# Altium project Icarus.PrjPcb
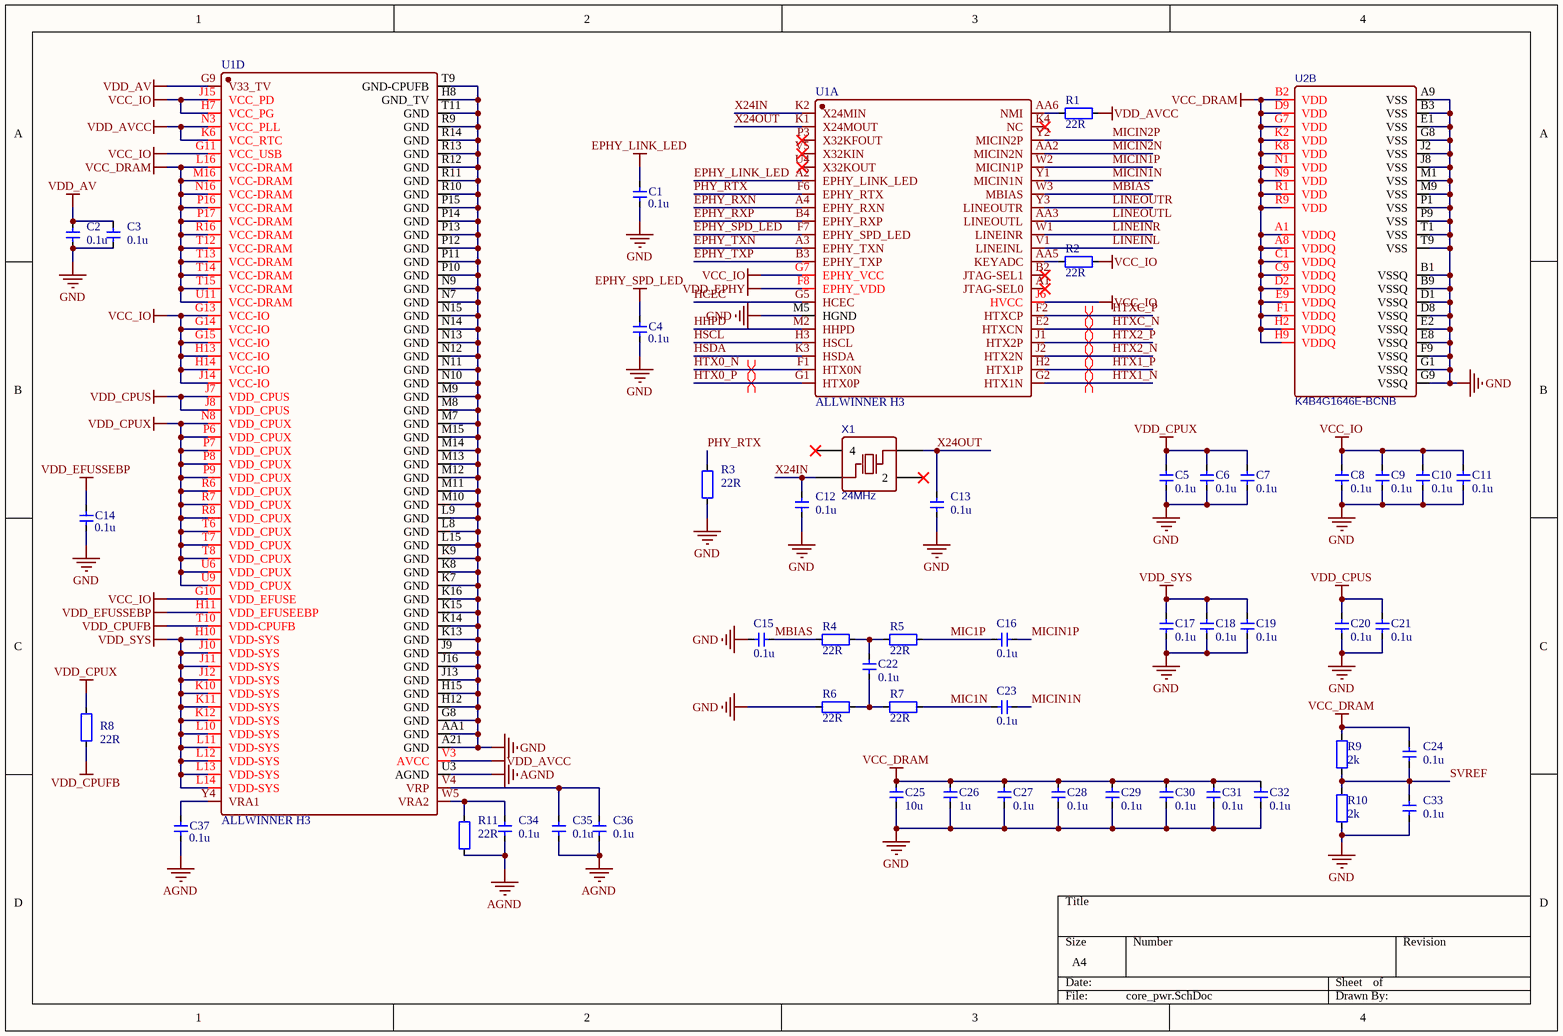
[diagram p0: core_pwr.SchDoc]
5 sheets, 134 parts. Net scope: global (net labels, ports and power ports of the same name join across sheets).
Board file: core.PcbDoc
Sheets:
  core_pwr.SchDoc
  core_app.SchDoc
  power.SchDoc
  conn.SchDoc
  peroherals.SchDoc

## Sheet core_pwr.SchDoc
size A4; SheetNumber: 1; SheetTotal: 5

### Parts
C1  value 0.1u  [C0402]  (hidden comment: CAP-0402)
C2  value 0.1u  [C0402]  (hidden comment: CAP-0402)
C3  value 0.1u  [C0402]  (hidden comment: CAP-0402)
C4  value 0.1u  [C0402]  (hidden comment: CAP-0402)
C5  value 0.1u  [C0402]  (hidden comment: CAP-0402)
C6  value 0.1u  [C0402]  (hidden comment: CAP-0402)
C7  value 0.1u  [C0402]  (hidden comment: CAP-0402)
C8  value 0.1u  [C0402]  (hidden comment: CAP-0402)
C9  value 0.1u  [C0402]  (hidden comment: CAP-0402)
C10  value 0.1u  [C0402]  (hidden comment: CAP-0402)
C11  value 0.1u  [C0402]  (hidden comment: CAP-0402)
C12  value 0.1u  [C0402]  (hidden comment: CAP-0402)
C13  value 0.1u  [C0402]  (hidden comment: CAP-0402)
C14  value 0.1u  [C0402]  (hidden comment: CAP-0402)
C15  value 0.1u  [C0402]  (hidden comment: CAP-0402)
C16  value 0.1u  [C0402]  (hidden comment: CAP-0402)
C17  value 0.1u  [C0402]  (hidden comment: CAP-0402)
C18  value 0.1u  [C0402]  (hidden comment: CAP-0402)
C19  value 0.1u  [C0402]  (hidden comment: CAP-0402)
C20  value 0.1u  [C0402]  (hidden comment: CAP-0402)
C21  value 0.1u  [C0402]  (hidden comment: CAP-0402)
C22  value 0.1u  [C0402]  (hidden comment: CAP-0402)
C23  value 0.1u  [C0402]  (hidden comment: CAP-0402)
C24  value 0.1u  [C0402]  (hidden comment: CAP-0402)
C25  value 10u  [C0402]  (hidden comment: CAP-0402)
C26  value 1u  [C0402]  (hidden comment: CAP-0402)
C27  value 0.1u  [C0402]  (hidden comment: CAP-0402)
C28  value 0.1u  [C0402]  (hidden comment: CAP-0402)
C29  value 0.1u  [C0402]  (hidden comment: CAP-0402)
C30  value 0.1u  [C0402]  (hidden comment: CAP-0402)
C31  value 0.1u  [C0402]  (hidden comment: CAP-0402)
C32  value 0.1u  [C0402]  (hidden comment: CAP-0402)
C33  value 0.1u  [C0402]  (hidden comment: CAP-0402)
C34  value 0.1u  [C0402]  (hidden comment: CAP-0402)
C35  value 0.1u  [C0402]  (hidden comment: CAP-0402)
C36  value 0.1u  [C0402]  (hidden comment: CAP-0402)
C37  value 0.1u  [C0402]  (hidden comment: CAP-0402)
R1  value 22R  [R0402]  (hidden comment: RES-0402)
R2  value 22R  [R0402]  (hidden comment: RES-0402)
R3  value 22R  [R0402]  (hidden comment: RES-0402)
R4  value 22R  [R0402]  (hidden comment: RES-0402)
R5  value 22R  [R0402]  (hidden comment: RES-0402)
R6  value 22R  [R0402]  (hidden comment: RES-0402)
R7  value 22R  [R0402]  (hidden comment: RES-0402)
R8  value 22R  [R0402]  (hidden comment: RES-0402)
R9  value 2k  [R0402]  (hidden comment: RES-0402)
R10  value 2k  [R0402]  (hidden comment: RES-0402)
R11  value 22R  [R0402]  (hidden comment: RES-0402)
U1  ALLWINNER H3  [BGA-347_L14.0-W14.0-R21-C21-P0.65-TL]  (parts A,D of 4)
U2  K4B4G1646E-BCNB  [FBGA-96_L13.5-W7.5-R16-C6-P0.80-TL]  (part B of 2)
X1  24MHz  [OSC-SMD_4P-L3.2-W2.5-BL]

### Nets
AGND: C34.1 C35.1 C36.1 C37.1 R11.1 U1.U3(AGND)
EPHY_LINK_LED: C1.2 U1.A2(EPHY_LINK_LED)
EPHY_SPD_LED: C4.2 U1.F7(EPHY_SPD_LED)
GND: C1.1 C2.1 C3.1 C4.1 C5.2 C6.2 C7.2 C8.2 C9.2 C10.2 C11.2 C12.1 C13.1 C14.1 C15.2 C17.2 C18.2 C19.2 C20.2 C21.2 C25.2 C26.2 C27.2 C28.2 C29.2 C30.2 C31.2 C32.2 C33.1 R3.1 R6.2 R10.2 U1.A21(GND) U1.AA1(GND) U1.G8(GND) U1.H8(GND_TV) U1.H12(GND) U1.H15(GND) U1.J9(GND) U1.J13(GND) U1.J16(GND) U1.K7(GND) U1.K8(GND) U1.K9(GND) U1.K13(GND) U1.K14(GND) U1.K15(GND) U1.K16(GND) U1.L8(GND) U1.L9(GND) U1.L15(GND) U1.M5(HGND) U1.M7(GND) U1.M8(GND) U1.M9(GND) U1.M10(GND) U1.M11(GND) U1.M12(GND) U1.M13(GND) U1.M14(GND) U1.M15(GND) U1.N7(GND) U1.N9(GND) U1.N10(GND) U1.N11(GND) U1.N12(GND) U1.N13(GND) U1.N14(GND) U1.N15(GND) U1.P10(GND) U1.P11(GND) U1.P12(GND) U1.P13(GND) U1.P14(GND) U1.P15(GND) U1.R9(GND) U1.R10(GND) U1.R11(GND) U1.R12(GND) U1.R13(GND) U1.R14(GND) U1.T9(GND-CPUFB) U1.T11(GND) U2.A9(VSS) U2.B1(VSSQ) U2.B3(VSS) U2.B9(VSSQ) U2.D1(VSSQ) U2.D8(VSSQ) U2.E1(VSS) U2.E2(VSSQ) U2.E8(VSSQ) U2.F9(VSSQ) U2.G1(VSSQ) U2.G8(VSS) U2.G9(VSSQ) U2.J2(VSS) U2.J8(VSS) U2.M1(VSS) U2.M9(VSS) U2.P1(VSS) U2.P9(VSS) U2.T1(VSS) U2.T9(VSS)
VCC_DRAM: C24.2 C25.1 C26.1 C27.1 C28.1 C29.1 C30.1 C31.1 C32.1 R9.1 U1.L16(VCC-DRAM) U1.M16(VCC-DRAM) U1.N16(VCC-DRAM) U1.P16(VCC-DRAM) U1.P17(VCC-DRAM) U1.R16(VCC-DRAM) U1.T12(VCC-DRAM) U1.T13(VCC-DRAM) U1.T14(VCC-DRAM) U1.T15(VCC-DRAM) U1.U11(VCC-DRAM) U2.A1(VDDQ) U2.A8(VDDQ) U2.B2(VDD) U2.C1(VDDQ) U2.C9(VDDQ) U2.D2(VDDQ) U2.D9(VDD) U2.E9(VDDQ) U2.F1(VDDQ) U2.G7(VDD) U2.H2(VDDQ) U2.H9(VDDQ) U2.K2(VDD) U2.K8(VDD) U2.N1(VDD) U2.N9(VDD) U2.R1(VDD) U2.R9(VDD)
VCC_IO: C8.1 C9.1 C10.1 C11.1 R2.1 U1.G7(EPHY_VCC) U1.G10(VDD_EFUSE) U1.G11(VCC_USB) U1.G13(VCC-IO) U1.G14(VCC-IO) U1.G15(VCC-IO) U1.H7(VCC_PG) U1.H13(VCC-IO) U1.H14(VCC-IO) U1.J6(HVCC) U1.J14(VCC-IO) U1.J15(VCC_PD)
VDD_AV: C2.2 C3.2 U1.G9(V33_TV)
VDD_AVCC: R1.1 U1.K6(VCC_RTC) U1.N3(VCC_PLL) U1.V3(AVCC)
VDD_CPUFB: R8.1 U1.T10(VDD-CPUFB)
VDD_CPUS: C20.1 C21.1 U1.J7(VDD_CPUS) U1.J8(VDD_CPUS)
VDD_CPUX: C5.1 C6.1 C7.1 R8.2 U1.N8(VDD_CPUX) U1.P6(VDD_CPUX) U1.P7(VDD_CPUX) U1.P8(VDD_CPUX) U1.P9(VDD_CPUX) U1.R6(VDD_CPUX) U1.R7(VDD_CPUX) U1.R8(VDD_CPUX) U1.T6(VDD_CPUX) U1.T7(VDD_CPUX) U1.T8(VDD_CPUX) U1.U6(VDD_CPUX) U1.U9(VDD_CPUX)
VDD_EFUSSEBP: C14.2 U1.H11(VDD_EFUSEEBP)
VDD_EPHY: U1.F8(EPHY_VDD)
VDD_SYS: C17.1 C18.1 C19.1 U1.H10(VDD-SYS) U1.J10(VDD-SYS) U1.J11(VDD-SYS) U1.J12(VDD-SYS) U1.K10(VDD-SYS) U1.K11(VDD-SYS) U1.K12(VDD-SYS) U1.L10(VDD-SYS) U1.L11(VDD-SYS) U1.L12(VDD-SYS) U1.L13(VDD-SYS) U1.L14(VDD-SYS)
EPHY_RXN: U1.A4(EPHY_RXN)
EPHY_RXP: U1.B4(EPHY_RXP)
EPHY_TXN: U1.A3(EPHY_TXN)
EPHY_TXP: U1.B3(EPHY_TXP)
HCEC: U1.G5(HCEC)
HHPD: U1.M2(HHPD)
HSCL: U1.H3(HSCL)
HSDA: U1.K3(HSDA)
HTX0_N: U1.F1(HTX0N)
HTX0_P: U1.G1(HTX0P)
HTX1_N: U1.G2(HTX1N)
HTX1_P: U1.H2(HTX1P)
HTX2_N: U1.J2(HTX2N)
HTX2_P: U1.J1(HTX2P)
HTXC_N: U1.E2(HTXCN)
HTXC_P: U1.F2(HTXCP)
LINEINL: U1.V1(LINEINL)
LINEINR: U1.W1(LINEINR)
LINEOUTL: U1.AA3(LINEOUTL)
LINEOUTR: U1.Y3(LINEOUTR)
MBIAS: C15.1 R4.2 U1.W3(MBIAS)
MIC1N: C23.1 R7.2
MIC1P: C16.2 R5.1
MICIN1N: C23.2 U1.Y1(MICIN1N)
MICIN1P: C16.1 U1.W2(MICIN1P)
MICIN2N: U1.AA2(MICIN2N)
MICIN2P: U1.Y2(MICIN2P)
PHY_RTX: R3.2 U1.F6(EPHY_RTX)
SVREF: C24.1 C33.2 R9.2 R10.1
X24IN: C12.2 U1.K2(X24MIN) X1.1(OSC1)
X24OUT: C13.2 U1.K1(X24MOUT) X1.3(OSC2)
NetC22_1: C22.1 R4.1 R5.2
NetC22_2: C22.2 R6.1 R7.1
NetC34_2: C34.2 R11.2 U1.W5(VRA2)
NetC35_2: C35.2 C36.2 U1.V4(VRP)
NetC37_2: C37.2 U1.Y4(VRA1)
NetR1_2: R1.2 U1.AA6(NMI)
NetR2_2: R2.2 U1.AA5(KEYADC)

Not connected (* = marked no-connect by the designer): U1 A1(JTAG-SEL0)* B2(JTAG-SEL1)* K4(NC)* P3(X32KFOUT)* U4(X32KOUT)* V5(X32KIN)*; X1 2* 4*

### Layout directives
differential pair: HTX0_N, HTX0_P, HTX1_N, HTX1_P, HTX2_N, HTX2_P, HTXC_N, HTXC_P

### Library data of the parts
C1-C37 = CAP-0402: Capacitor
R1-R11 = RES-0402: Resistor
U2 = K4B4G1646E-BCNB: BOM_Manufacturer: SAMSUNG(三星半导体); Contributor: LCSC; BOM_Supplier Part: C2803248; BOM_Manufacturer Part: K4B4G1646E-BCNB; BOM_JLCPCB Part Class: Extended Part; spicePre: U; spiceSymbolName: K4B4G1646E-BCNB; BOM_Supplier: LCSC
X1 = 24MHz: BOM_Manufacturer: KDS; BOM_Manufacturer Part: DSX321G 24MHz; nameAlias: Frequency; Contributor: LCSC; BOM_Supplier: LCSC; BOM_Supplier Part: C93235; BOM_JLCPCB Part Class: Extended Part; spicePre: X; spiceSymbolName: DSX321G 24MHz

## Sheet core_app.SchDoc
size A4; SheetNumber: 2; SheetTotal: 5
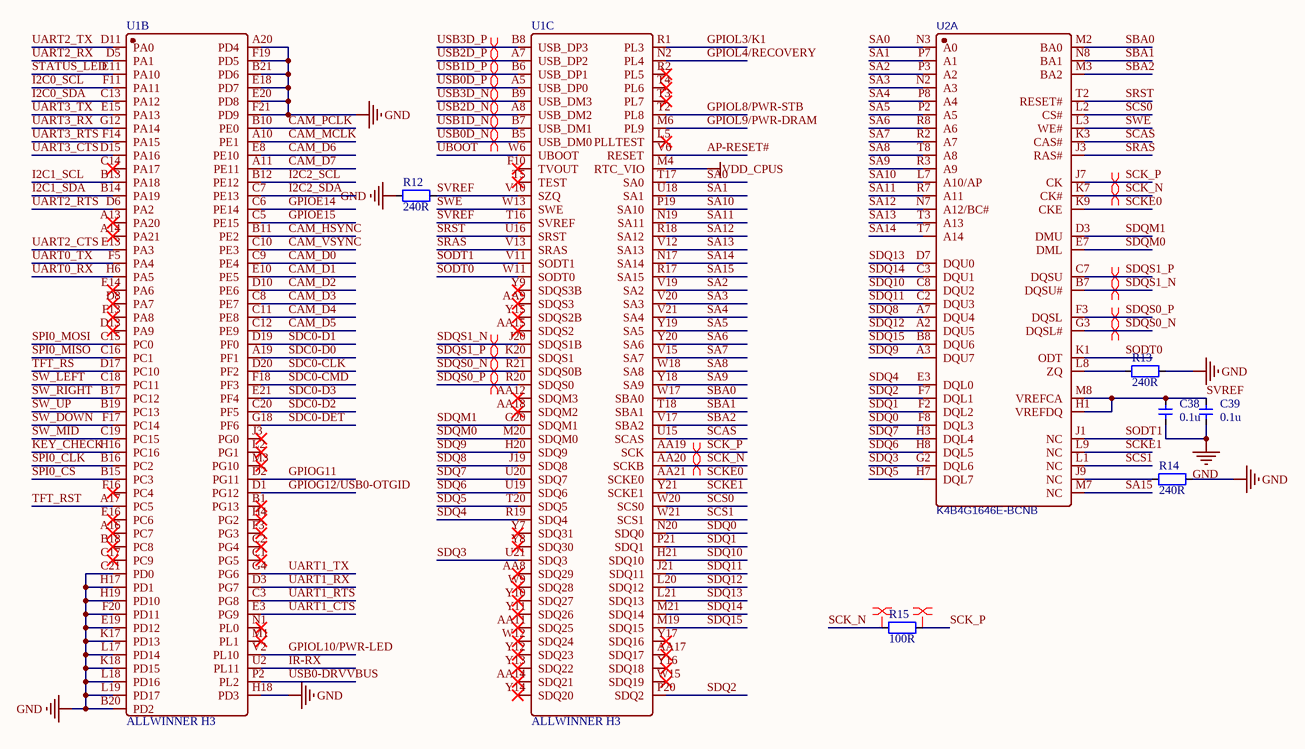
[diagram p1: core_app.SchDoc]

### Parts
C38  value 0.1u  [C0402]  (hidden comment: CAP-0402)
C39  value 0.1u  [C0402]  (hidden comment: CAP-0402)
R12  value 240R  [R0402]  (hidden comment: RES-0402)
R13  value 240R  [R0402]  (hidden comment: RES-0402)
R14  value 240R  [R0402]  (hidden comment: RES-0402)
R15  value 100R  [R0402]  (hidden comment: RES-0402)
U1  ALLWINNER H3  [BGA-347_L14.0-W14.0-R21-C21-P0.65-TL]  (parts B,C of 4)
U2  K4B4G1646E-BCNB  [FBGA-96_L13.5-W7.5-R16-C6-P0.80-TL]  (part A of 2)

### Nets
GND: C38.1 C39.1 R12.2 R13.1 R14.1 U1.A20(PD4) U1.B20(PD2) U1.B21(PD6) U1.C21(PD0) U1.E18(PD7) U1.E19(PD12) U1.E20(PD8) U1.F19(PD5) U1.F20(PD11) U1.F21(PD9) U1.H17(PD1) U1.H18(PD3) U1.H19(PD10) U1.K17(PD13) U1.K18(PD15) U1.L17(PD14) U1.L18(PD16) U1.L19(PD17)
VDD_CPUS: U1.M4(RTC_VIO)
AP-RESET#: U1.V6(RESET)
CAM_D0: U1.C9(PE4)
CAM_D1: U1.E10(PE5)
CAM_D2: U1.D10(PE6)
CAM_D3: U1.C8(PE7)
CAM_D4: U1.C11(PE8)
CAM_D5: U1.C12(PE9)
CAM_D6: U1.E8(PE10)
CAM_D7: U1.A11(PE11)
CAM_HSYNC: U1.B11(PE2)
CAM_MCLK: U1.A10(PE1)
CAM_PCLK: U1.B10(PE0)
CAM_VSYNC: U1.C10(PE3)
GPIOE14: U1.C6(PE14)
GPIOE15: U1.C5(PE15)
GPIOG11: U1.D2(PG11)
GPIOG12/USB0-OTGID: U1.D1(PG12)
GPIOL3/K1: U1.R1(PL3)
GPIOL4/RECOVERY: U1.N2(PL4)
GPIOL8/PWR-STB: U1.T2(PL8)
GPIOL9/PWR-DRAM: U1.M6(PL9)
GPIOL10/PWR-LED: U1.V2(PL10)
I2C0_SCL: U1.F11(PA11)
I2C0_SDA: U1.C13(PA12)
I2C1_SCL: U1.B13(PA18)
I2C1_SDA: U1.B14(PA19)
I2C2_SCL: U1.B12(PE12)
I2C2_SDA: U1.C7(PE13)
IR-RX: U1.U2(PL11)
KEY_CHECK: U1.H16(PC16)
SA0: U1.T17(SA0) U2.N3(A0)
SA1: U1.U18(SA1) U2.P7(A1)
SA2: U1.V19(SA2) U2.P3(A2)
SA3: U1.V20(SA3) U2.N2(A3)
SA4: U1.V21(SA4) U2.P8(A4)
SA5: U1.Y19(SA5) U2.P2(A5)
SA6: U1.Y20(SA6) U2.R8(A6)
SA7: U1.V15(SA7) U2.R2(A7)
SA8: U1.W18(SA8) U2.T8(A8)
SA9: U1.Y18(SA9) U2.R3(A9)
SA10: U1.P19(SA10) U2.L7(A10/AP)
SA11: U1.N19(SA11) U2.R7(A11)
SA12: U1.R18(SA12) U2.N7(A12/BC#)
SA13: U1.V12(SA13) U2.T3(A13)
SA14: U1.N17(SA14) U2.T7(A14)
SA15: U1.R17(SA15) U2.M7(NC)
SBA0: U1.W17(SBA0) U2.M2(BA0)
SBA1: U1.T18(SBA1) U2.N8(BA1)
SBA2: U1.V17(SBA2) U2.M3(BA2)
SCAS: U1.U15(SCAS) U2.K3(CAS#)
SCK_N: R15.2 U1.AA20(SCKB) U2.K7(CK#)
SCK_P: R15.1 U1.AA19(SCK) U2.J7(CK)
SCKE0: U1.AA21(SCKE0) U2.K9(CKE)
SCKE1: U1.Y21(SCKE1) U2.L9(NC)
SCS0: U1.W20(SCS0) U2.L2(CS#)
SCS1: U1.W21(SCS1) U2.L1(NC)
SDC0-CLK: U1.D20(PF2)
SDC0-CMD: U1.F18(PF3)
SDC0-D0: U1.A19(PF1)
SDC0-D1: U1.D19(PF0)
SDC0-D2: U1.C20(PF5)
SDC0-D3: U1.E21(PF4)
SDC0-DET: U1.G18(PF6)
SDQ0: U1.N20(SDQ0) U2.F8(DQL3)
SDQ1: U1.P21(SDQ1) U2.F2(DQL2)
SDQ2: U1.P20(SDQ2) U2.F7(DQL1)
SDQ3: U1.U21(SDQ3) U2.G2(DQL6)
SDQ4: U1.R19(SDQ4) U2.E3(DQL0)
SDQ5: U1.T20(SDQ5) U2.H7(DQL7)
SDQ6: U1.U19(SDQ6) U2.H8(DQL5)
SDQ7: U1.U20(SDQ7) U2.H3(DQL4)
SDQ8: U1.J19(SDQ8) U2.A7(DQU4)
SDQ9: U1.H20(SDQ9) U2.A3(DQU7)
SDQ10: U1.H21(SDQ10) U2.C8(DQU2)
SDQ11: U1.J21(SDQ11) U2.C2(DQU3)
SDQ12: U1.L20(SDQ12) U2.A2(DQU5)
SDQ13: U1.L21(SDQ13) U2.D7(DQU0)
SDQ14: U1.M21(SDQ14) U2.C3(DQU1)
SDQ15: U1.M19(SDQ15) U2.B8(DQU6)
SDQM0: U1.M20(SDQM0) U2.E7(DML)
SDQM1: U1.G20(SDQM1) U2.D3(DMU)
SDQS0_N: U1.R21(SDQS0B) U2.G3(DQSL#)
SDQS0_P: U1.R20(SDQS0) U2.F3(DQSL)
SDQS1_N: U1.J20(SDQS1B) U2.B7(DQSU#)
SDQS1_P: U1.K20(SDQS1) U2.C7(DQSU)
SODT0: U1.W11(SODT0) U2.K1(ODT)
SODT1: U1.V11(SODT1) U2.J1(NC)
SPI0_CLK: U1.B16(PC2)
SPI0_CS: U1.B15(PC3)
SPI0_MISO: U1.C16(PC1)
SPI0_MOSI: U1.C15(PC0)
SRAS: U1.V13(SRAS) U2.J3(RAS#)
SRST: U1.U16(SRST) U2.T2(RESET#)
STATUS_LED: U1.E11(PA10)
SVREF: C38.2 C39.2 R12.1 U1.T16(SVREF) U1.V10(SZQ) U2.H1(VREFDQ) U2.M8(VREFCA)
SW_DOWN: U1.F17(PC14)
SW_LEFT: U1.C18(PC11)
SW_MID: U1.C19(PC15)
SW_RIGHT: U1.B17(PC12)
SW_UP: U1.B19(PC13)
SWE: U1.W13(SWE) U2.L3(WE#)
TFT_RS: U1.D17(PC10)
TFT_RST: U1.A17(PC5)
UART0_RX: U1.H6(PA5)
UART0_TX: U1.F5(PA4)
UART1_CTS: U1.E3(PG9)
UART1_RTS: U1.C3(PG8)
UART1_RX: U1.D3(PG7)
UART1_TX: U1.G4(PG6)
UART2_CTS: U1.E13(PA3)
UART2_RTS: U1.D6(PA2)
UART2_RX: U1.D5(PA1)
UART2_TX: U1.D11(PA0)
UART3_CTS: U1.D15(PA16)
UART3_RTS: U1.F14(PA15)
UART3_RX: U1.G12(PA14)
UART3_TX: U1.E15(PA13)
UBOOT: U1.W6(UBOOT)
USB0-DRVVBUS: U1.P2(PL2)
USB0D_N: U1.B5(USB_DM0)
USB0D_P: U1.A5(USB_DP0)
USB1D_N: U1.B7(USB_DM1)
USB1D_P: U1.B6(USB_DP1)
USB2D_N: U1.A8(USB_DM2)
USB2D_P: U1.A7(USB_DP2)
USB3D_N: U1.B9(USB_DM3)
USB3D_P: U1.B8(USB_DP3)
NetR13_2: R13.2 U2.L8(ZQ)
NetR14_2: R14.2 U2.J9(NC)

Not connected (* = marked no-connect by the designer): U1 A13(PA20)* A14(PA21)* A16(PC7)* AA8(SDQ29)* AA9(SDQS3)* AA11(SDQ25)* AA12(SDQM3)* AA14(SDQ21)* AA15(SDQS2)* AA17(SDQ17)* AA18(SDQM2)* B1(PG13)* B18(PC8)* C1(PG5)* C2(PG4)* C14(PA17)* C17(PC9)* D8(PA7)* D13(PA9)* E14(PA6)* E16(PC6)* F3(PG3)* F10(TVOUT)* F13(PA8)* F16(PC4)* H4(PG2)* J3(PG0)* L2(PG1)* L5(PLLTEST)* M1(PL1)* M3(PG10)* N1(PL0)* R2(PL5)* T3(PL7)* T4(PL6)* T5(TEST)* W9(SDQ28)* W12(SDQ24)* W15(SDQ19)* Y7(SDQ31)* Y8(SDQ30)* Y9(SDQS3B)* Y10(SDQ27)* Y11(SDQ26)* Y12(SDQ23)* Y13(SDQ22)* Y14(SDQ20)* Y15(SDQS2B)* Y16(SDQ18)* Y17(SDQ16)*

### Layout directives
differential pair: SCK_N, SCK_P, SDQS0_N, SDQS0_P, SDQS1_N, SDQS1_P, USB0D_N, USB0D_P, USB1D_N, USB1D_P, USB2D_N, USB2D_P, USB3D_N, USB3D_P

### Library data of the parts
C38 C39 = CAP-0402: Capacitor
R12-R15 = RES-0402: Resistor
U2 = K4B4G1646E-BCNB: as U2 on sheet core_pwr; BOM_Supplier Part: C2803248; BOM_Manufacturer Part: K4B4G1646E-BCNB; BOM_JLCPCB Part Class: Extended Part; spicePre: U; spiceSymbolName: K4B4G1646E-BCNB; BOM_Supplier: LCSC

## Sheet power.SchDoc
size A4; SheetNumber: 3; SheetTotal: 5
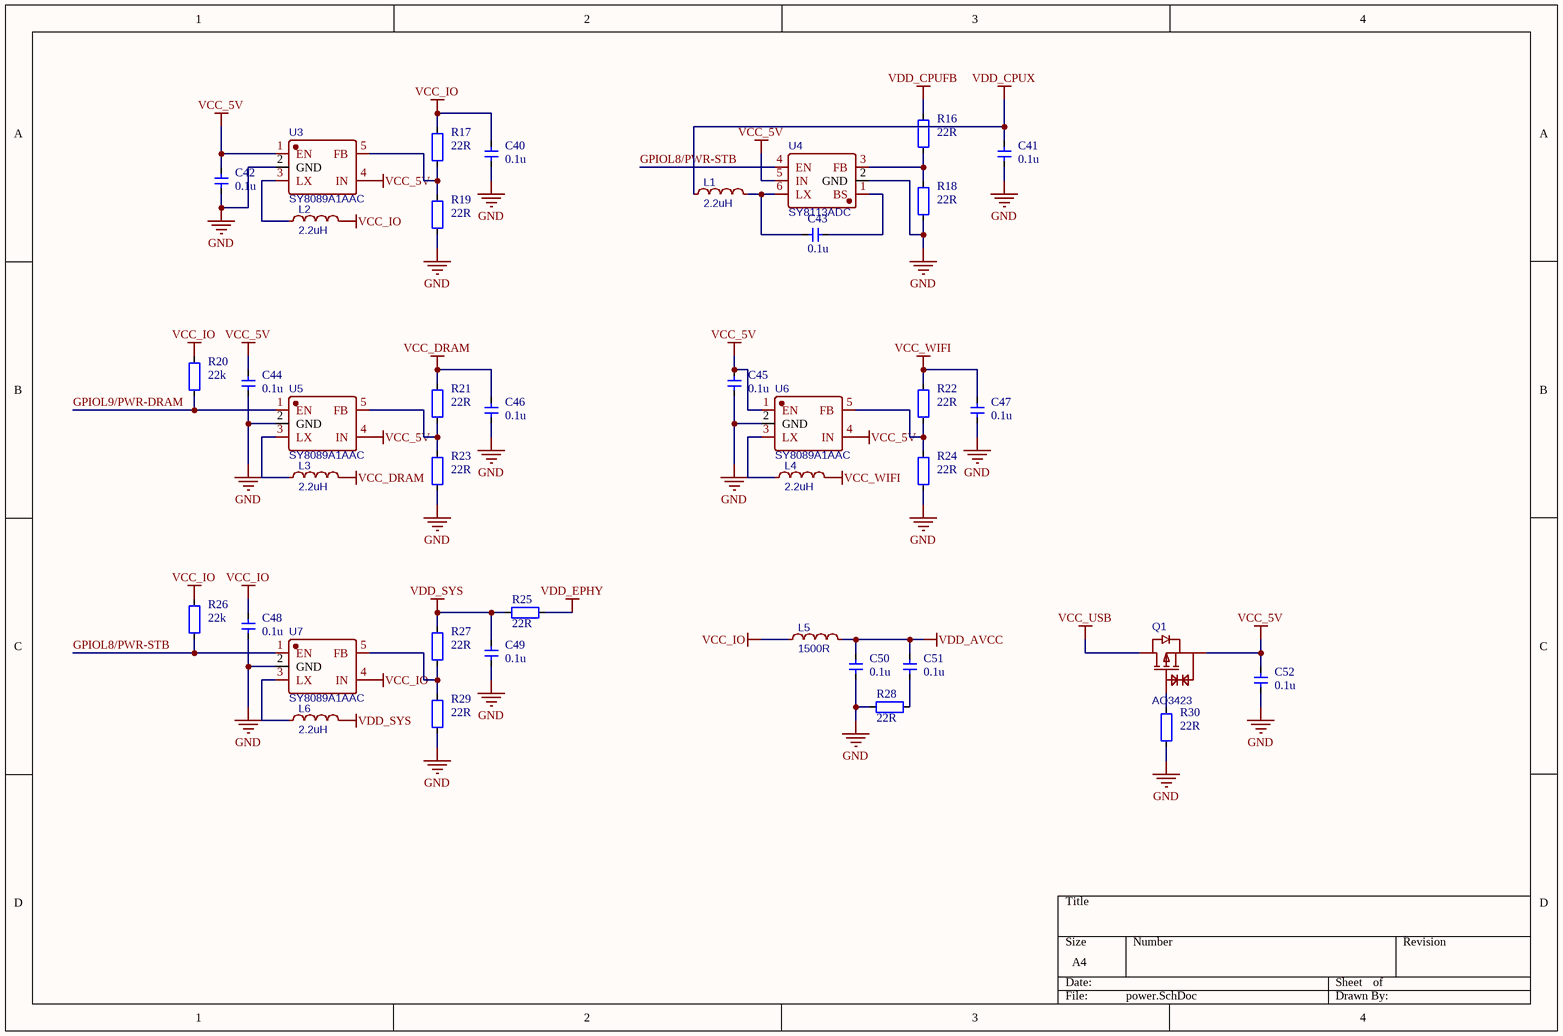
[diagram p2: power.SchDoc]

### Parts
C40  value 0.1u  [C0402]  (hidden comment: CAP-0402)
C41  value 0.1u  [C0402]  (hidden comment: CAP-0402)
C42  value 0.1u  [C0402]  (hidden comment: CAP-0402)
C43  value 0.1u  [C0402]  (hidden comment: CAP-0402)
C44  value 0.1u  [C0402]  (hidden comment: CAP-0402)
C45  value 0.1u  [C0402]  (hidden comment: CAP-0402)
C46  value 0.1u  [C0402]  (hidden comment: CAP-0402)
C47  value 0.1u  [C0402]  (hidden comment: CAP-0402)
C48  value 0.1u  [C0402]  (hidden comment: CAP-0402)
C49  value 0.1u  [C0402]  (hidden comment: CAP-0402)
C50  value 0.1u  [C0402]  (hidden comment: CAP-0402)
C51  value 0.1u  [C0402]  (hidden comment: CAP-0402)
C52  value 0.1u  [C0402]  (hidden comment: CAP-0402)
L1  2.2uH  [IND-SMD_L4.4-W4.2]
L2  2.2uH  [IND-SMD_L4.4-W4.2]
L3  2.2uH  [IND-SMD_L4.4-W4.2]
L4  2.2uH  [IND-SMD_L4.4-W4.2]
L5  1500R  [L0402]
L6  2.2uH  [IND-SMD_L4.4-W4.2]
Q1  AO3423  [SOT-23-3_L2.9-W1.6-P1.90-LS2.8-BR]
R16  value 22R  [R0402]  (hidden comment: RES-0402)
R17  value 22R  [R0402]  (hidden comment: RES-0402)
R18  value 22R  [R0402]  (hidden comment: RES-0402)
R19  value 22R  [R0402]  (hidden comment: RES-0402)
R20  value 22k  [R0402]  (hidden comment: RES-0402)
R21  value 22R  [R0402]  (hidden comment: RES-0402)
R22  value 22R  [R0402]  (hidden comment: RES-0402)
R23  value 22R  [R0402]  (hidden comment: RES-0402)
R24  value 22R  [R0402]  (hidden comment: RES-0402)
R25  value 22R  [R0402]  (hidden comment: RES-0402)
R26  value 22k  [R0402]  (hidden comment: RES-0402)
R27  value 22R  [R0402]  (hidden comment: RES-0402)
R28  value 22R  [R0402]  (hidden comment: RES-0402)
R29  value 22R  [R0402]  (hidden comment: RES-0402)
R30  value 22R  [R0402]  (hidden comment: RES-0402)
U3  SY8089A1AAC  [SOT-23-5_L3.0-W1.7-P0.95-LS2.8-BL]
U4  SY8113ADC  [TSOT-23-6_L2.9-W1.6-P0.95-LS2.8-BR]
U5  SY8089A1AAC  [SOT-23-5_L3.0-W1.7-P0.95-LS2.8-BL]
U6  SY8089A1AAC  [SOT-23-5_L3.0-W1.7-P0.95-LS2.8-BL]
U7  SY8089A1AAC  [SOT-23-5_L3.0-W1.7-P0.95-LS2.8-BL]

### Nets
GND: C40.1 C41.1 C42.1 C44.1 C45.1 C46.1 C47.1 C48.1 C49.1 C50.1 C52.1 R18.1 R19.1 R23.1 R24.1 R28.2 R29.1 R30.1 U3.2(GND) U4.2(GND) U5.2(GND) U6.2(GND) U7.2(GND)
VCC_5V: C42.2 C44.2 C45.2 C52.2 Q1.2(S) U3.1(EN) U3.4(IN) U4.5(IN) U5.4(IN) U6.1(EN) U6.4(IN)
VCC_DRAM: C46.2 L3.2 R21.2
VCC_IO: C40.2 C48.2 L2.2 L5.1 R17.2 R20.2 R26.2 U7.4(IN)
VCC_USB: Q1.3(D)
VCC_WIFI: C47.2 L4.2 R22.2
VDD_AVCC: C50.2 C51.2 L5.2
VDD_CPUFB: R16.2
VDD_CPUX: C41.2 L1.1
VDD_EPHY: R25.1
VDD_SYS: C49.2 L6.2 R25.2 R27.2
GPIOL8/PWR-STB: R26.1 U4.4(EN) U7.1(EN)
GPIOL9/PWR-DRAM: R20.1 U5.1(EN)
NetC43_1: C43.1 U4.1(BS)
NetC43_2: C43.2 L1.2 U4.6(LX)
NetC51_1: C51.1 R28.1
NetL2_1: L2.1 U3.3(LX)
NetL3_1: L3.1 U5.3(LX)
NetL4_1: L4.1 U6.3(LX)
NetL6_1: L6.1 U7.3(LX)
NetQ1_1: Q1.1(G) R30.2
NetR16_1: R16.1 R18.2 U4.3(FB)
NetR17_1: R17.1 R19.2 U3.5(FB)
NetR21_1: R21.1 R23.2 U5.5(FB)
NetR22_1: R22.1 R24.2 U6.5(FB)
NetR27_1: R27.1 R29.2 U7.5(FB)

### Library data of the parts
C40-C52 = CAP-0402: Capacitor
L1-L4 L6 = IND_0420: BOM_Manufacturer: TDG; BOM_Manufacturer Part: TMAX-0420-2R2-M; nameAlias: Inductance; Contributor: LCSC; BOM_Supplier: LCSC; BOM_Supplier Part: C429763; spicePre: L; spiceSymbolName: TMAX-0420-2R2-M
L5 = IND_0402: nameAlias: Value(H); Contributor: LCEDA_Lib; spicePre: L; spiceSymbolName: L0402_US
Q1 = AO3423: BOM_Manufacturer: AOS; BOM_Supplier: LCSC; BOM_Manufacturer Part: AO3423; BOM_Supplier Part: C73257; BOM_JLCPCB Part Class: Extended Part; spicePre: Q; spiceSymbolName: AO3423
R16-R30 = RES-0402: Resistor
U3 U5-U7 = SY8089A1AAC: BOM_Manufacturer: Silergy Corp; Contributor: LCSC; BOM_Supplier: LCSC; BOM_Supplier Part: C479074; BOM_Manufacturer Part: SY8089A1AAC; BOM_JLCPCB Part Class: Extended Part; spicePre: U; spiceSymbolName: SY8089A1AAC
U4 = SY8113ADC: BOM_Manufacturer: Silergy Corp; Contributor: LCSC; BOM_Supplier: LCSC; BOM_Supplier Part: C403810; BOM_Manufacturer Part: SY8113ADC; BOM_JLCPCB Part Class: Extended Part; spicePre: U; spiceSymbolName: SY8113ADC

## Sheet conn.SchDoc
size A4; SheetNumber: 4; SheetTotal: 5
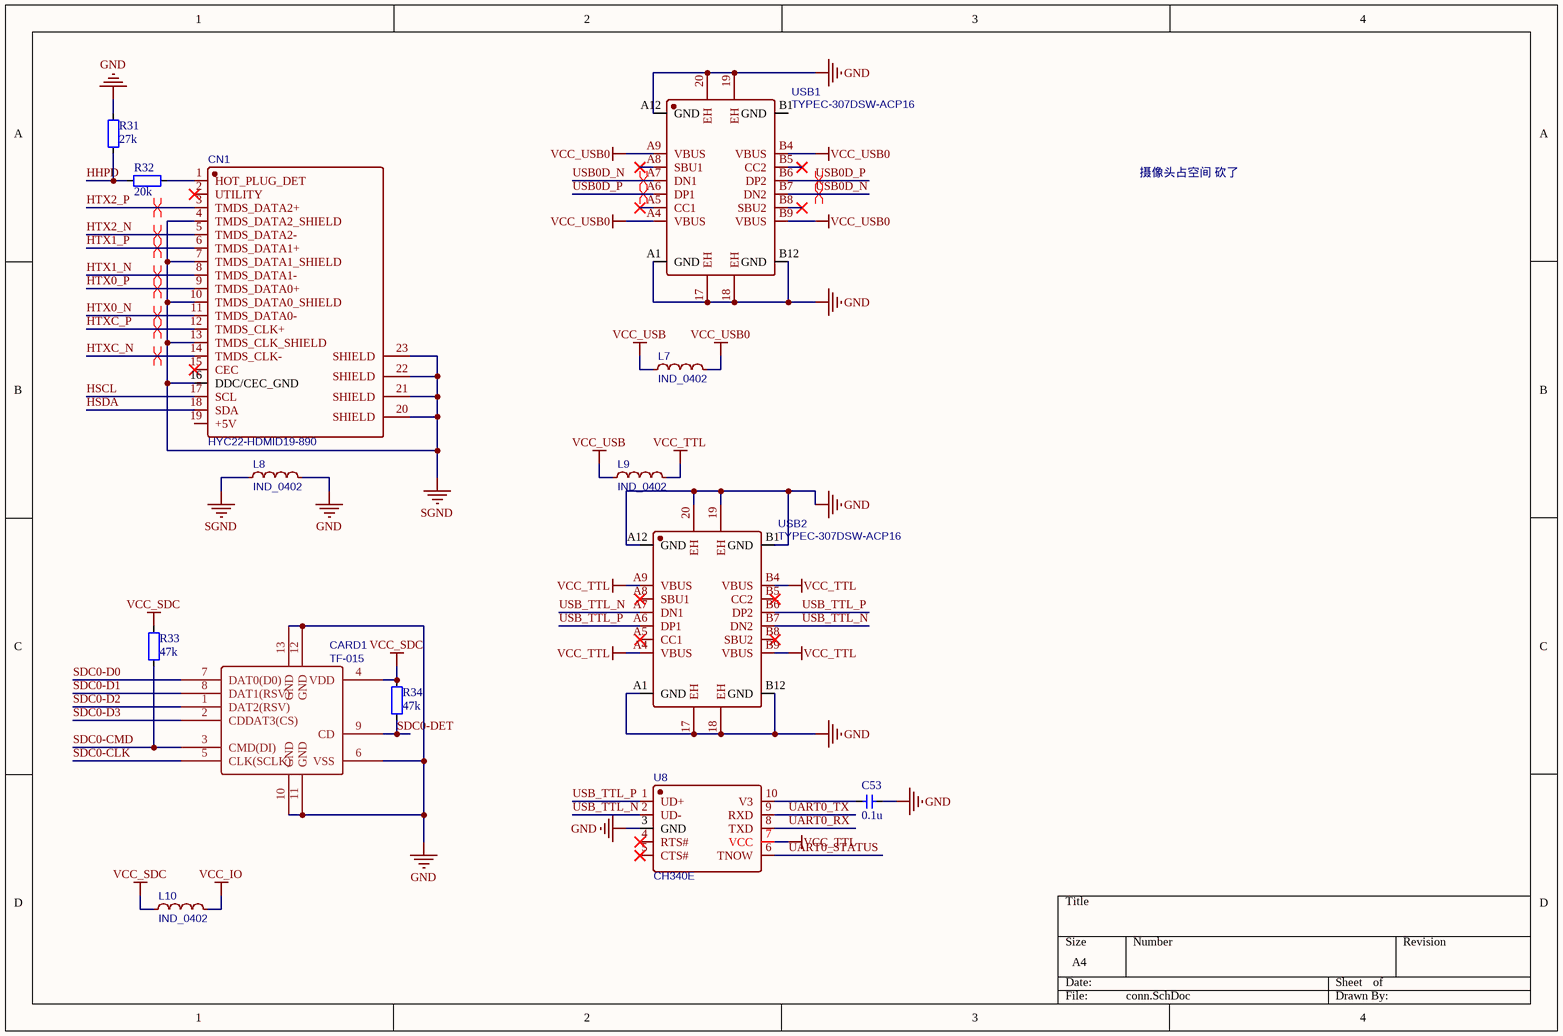
[diagram p3: conn.SchDoc]

### Parts
C53  value 0.1u  [C0402]  (hidden comment: CAP-0402)
CARD1  TF-015  [TF-SMD_TF-015]
CN1  HYC22-HDMID19-890  [HDMI-SMD_HYC22-HDMID19-890]
L7  IND_0402  [L0402]
L8  IND_0402  [L0402]
L9  IND_0402  [L0402]
L10  IND_0402  [L0402]
R31  value 27k  [R0402]  (hidden comment: RES-0402)
R32  value 20k  [R0402]  (hidden comment: RES-0402)
R33  value 47k  [R0402]  (hidden comment: RES-0402)
R34  value 47k  [R0402]  (hidden comment: RES-0402)
U8  CH340E  [MSOP-10_L3.0-W3.0-P0.50-LS5.0-BL]
USB1  TYPEC-307DSW-ACP16  [USB-C-SMD_TYPEC-307DSW-ACP16]
USB2  TYPEC-307DSW-ACP16  [USB-C-SMD_TYPEC-307DSW-ACP16]

### Nets
GND: C53.1 CARD1.6(VSS) CARD1.10(GND) CARD1.11(GND) CARD1.12(GND) CARD1.13(GND) L8.2 R31.1 U8.3(GND) USB1.17(EH) USB1.18(EH) USB1.19(EH) USB1.20(EH) USB1.A1(GND) USB1.A12(GND) USB1.B12(GND) USB2.17(EH) USB2.18(EH) USB2.19(EH) USB2.20(EH) USB2.A1(GND) USB2.A12(GND) USB2.B1(GND) USB2.B12(GND)
SGND: CN1.4(TMDS_DATA2_SHIELD) CN1.7(TMDS_DATA1_SHIELD) CN1.10(TMDS_DATA0_SHIELD) CN1.13(TMDS_CLK_SHIELD) CN1.16(DDC/CEC_GND) CN1.20(SHIELD) CN1.21(SHIELD) CN1.22(SHIELD) CN1.23(SHIELD) L8.1
VCC_IO: L10.2
VCC_SDC: CARD1.4(VDD) L10.1 R33.1 R34.1
VCC_TTL: L9.2 U8.7(VCC) USB2.A4(VBUS) USB2.A9(VBUS) USB2.B4(VBUS) USB2.B9(VBUS)
VCC_USB: L7.1 L9.1
VCC_USB0: L7.2 USB1.A4(VBUS) USB1.A9(VBUS) USB1.B4(VBUS) USB1.B9(VBUS)
HHPD: R31.2 R32.2
HSCL: CN1.17(SCL)
HSDA: CN1.18(SDA)
HTX0_N: CN1.11(TMDS_DATA0-)
HTX0_P: CN1.9(TMDS_DATA0+)
HTX1_N: CN1.8(TMDS_DATA1-)
HTX1_P: CN1.6(TMDS_DATA1+)
HTX2_N: CN1.5(TMDS_DATA2-)
HTX2_P: CN1.3(TMDS_DATA2+)
HTXC_N: CN1.14(TMDS_CLK-)
HTXC_P: CN1.12(TMDS_CLK+)
SDC0-CLK: CARD1.5(CLK(SCLK))
SDC0-CMD: CARD1.3(CMD(DI)) R33.2
SDC0-D0: CARD1.7(DAT0(D0))
SDC0-D1: CARD1.8(DAT1(RSV))
SDC0-D2: CARD1.1(DAT2(RSV))
SDC0-D3: CARD1.2(CDDAT3(CS))
SDC0-DET: CARD1.9(CD) R34.2
UART0_RX: U8.8(TXD)
UART0_STATUS: U8.6(TNOW)
UART0_TX: U8.9(RXD)
USB0D_N: USB1.A7(DN1) USB1.B7(DN2)
USB0D_P: USB1.A6(DP1) USB1.B6(DP2)
USB_TTL_N: U8.2(UD-) USB2.A7(DN1) USB2.B7(DN2)
USB_TTL_P: U8.1(UD+) USB2.A6(DP1) USB2.B6(DP2)
NetC53_2: C53.2 U8.10(V3)
NetCN1_1: CN1.1(HOT_PLUG_DET) R32.1

Not connected (* = marked no-connect by the designer): CN1 2(UTILITY)* 15(CEC)* 19(+5V); U8 4(RTS#)* 5(CTS#)*; USB1 A5(CC1)* A8(SBU1)* B1(GND) B5(CC2)* B8(SBU2)*; USB2 A5(CC1)* A8(SBU1)* B5(CC2)* B8(SBU2)*

### Layout directives
differential pair: HTX0_N, HTX0_P, HTX1_N, HTX1_P, HTX2_N, HTX2_P, HTXC_N, HTXC_P, USB0D_N, USB0D_P

### Notes on the sheet
- 摄像头占空间 砍了

### Library data of the parts
C53 = CAP-0402: Capacitor
CARD1 = TF-015: BOM_Manufacturer: SOFNG; BOM_Supplier: LCSC; BOM_Manufacturer Part: TF-015; BOM_Supplier Part: C113206; spicePre: C; spiceSymbolName: TF-015
CN1 = HYC22-HDMID19-890: BOM_Manufacturer: HOAUC; Contributor: LCSC; BOM_Supplier: LCSC; BOM_Supplier Part: C711356; BOM_Manufacturer Part: HYC22-HDMID19-890; BOM_JLCPCB Part Class: Extended Part; spicePre: C; spiceSymbolName: HYC22-HDMID19-890
L7-L10 = IND_0402: as L5 on sheet power; spicePre: L; spiceSymbolName: L0402_US
R31-R34 = RES-0402: Resistor
U8 = CH340E: BOM_Manufacturer: WCH; BOM_Supplier: LCSC; BOM_Manufacturer Part: CH340E; BOM_Supplier Part: C99652; BOM_JLCPCB Part Class: Extended Part; spicePre: U; spiceSymbolName: CH340E
USB1 USB2 = TYPEC-307DSW-ACP16: BOM_Manufacturer: XUNPU(讯普); Contributor: LCSC; BOM_Supplier: LCSC; BOM_Supplier Part: C2840402; BOM_Manufacturer Part: TYPEC-307DSW-ACP16; spicePre: U; spiceSymbolName: TYPEC-307DSW-ACP16

## Sheet peroherals.SchDoc
size A4; SheetNumber: 5; SheetTotal: 5
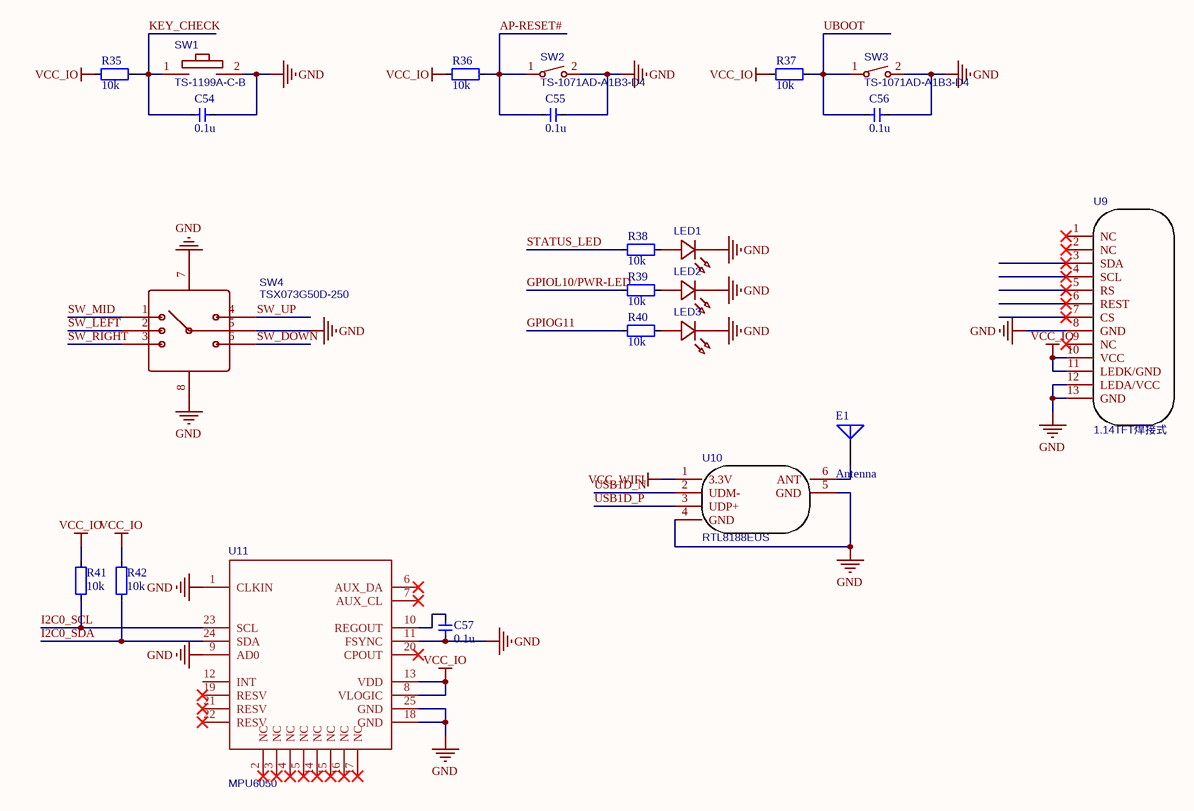
[diagram p4: peroherals.SchDoc]

### Parts
C54  value 0.1u  [C0402]  (hidden comment: CAP-0402)
C55  value 0.1u  [C0402]  (hidden comment: CAP-0402)
C56  value 0.1u  [C0402]  (hidden comment: CAP-0402)
C57  value 0.1u  [C0402]  (hidden comment: CAP-0402)
E1  Antenna  [PIN1]
LED1  TJ-S1005CL4T5ALC6B-A5  [LED0402-RD]  (value not drawn)
LED2  TJ-S1005CL4T5ALC6B-A5  [LED0402-RD]  (value not drawn)
LED3  TJ-S1005CL4T5ALC6B-A5  [LED0402-RD]  (value not drawn)
R35  value 10k  [R0402]  (hidden comment: RES-0402)
R36  value 10k  [R0402]  (hidden comment: RES-0402)
R37  value 10k  [R0402]  (hidden comment: RES-0402)
R38  value 10k  [R0402]  (hidden comment: RES-0402)
R39  value 10k  [R0402]  (hidden comment: RES-0402)
R40  value 10k  [R0402]  (hidden comment: RES-0402)
R41  value 10k  [R0402]  (hidden comment: RES-0402)
R42  value 10k  [R0402]  (hidden comment: RES-0402)
SW1  TS-1199A-C-B  [KEY-SMD_2P-L6.0-W6.0-P6.50]
SW2  TS-1071AD-A1B3-D4  [ButtonTACT_3x4x2_180]
SW3  TS-1071AD-A1B3-D4  [ButtonTACT_3x4x2_180]
SW4  TSX073G50D-250  [SW-SMD_TSX073G50D1-250]
U9  1.14TFT焊接式  [1.14TFT焊接式B]
U10  RTL8188EUS  [USB-WIFI-ANT]
U11  MPU6050  [QFN50P400X400X95-25T265X275N]

### Nets
GND: C54.1 C55.1 C56.1 C57.2 LED1.1(K) LED2.1(K) LED3.1(K) SW1.2 SW2.2 SW3.2 SW4.5(COM) SW4.7(GND) SW4.8(GND) U9.8(GND) U9.12(LEDA/VCC) U9.13(GND) U10.4(GND) U10.5(GND) U11.1(CLKIN) U11.9(AD0) U11.11(FSYNC) U11.18(GND) U11.25(GND)
VCC_IO: R35.2 R36.2 R37.2 R41.1 R42.1 U9.10(VCC) U9.11(LEDK/GND) U11.8(VLOGIC) U11.13(VDD)
VCC_WIFI: U10.1(3.3V)
AP-RESET#: C55.2 R36.1 SW2.1
GPIOG11: R40.2
GPIOL10/PWR-LED: R39.2
I2C0_SCL: R41.2 U11.23(SCL)
I2C0_SDA: R42.2 U11.24(SDA)
KEY_CHECK: C54.2 R35.1 SW1.1
STATUS_LED: R38.2
SW_DOWN: SW4.6(C)
SW_LEFT: SW4.2(CENTER)
SW_MID: SW4.1(A)
SW_RIGHT: SW4.3(B)
SW_UP: SW4.4(D)
UBOOT: C56.2 R37.1 SW3.1
USB1D_N: U10.2(UDM-)
USB1D_P: U10.3(UDP+)
NetC57_1: C57.1 U11.10(REGOUT)
NetE1_1: E1.1(A) U10.6(ANT)
NetLED1_2: LED1.2(A) R38.1
NetLED2_2: LED2.2(A) R39.1
NetLED3_2: LED3.2(A) R40.1

Not connected (* = marked no-connect by the designer): U9 1(NC)* 2(NC)* 3(SDA)* 4(SCL)* 5(RS)* 6(REST)* 7(CS)* 9(NC)*; U11 2(NC)* 3(NC)* 4(NC)* 5(NC)* 6(AUX_DA)* 7(AUX_CL)* 12(INT) 14(NC)* 15(NC)* 16(NC)* 17(NC)* 19(RESV)* 20(CPOUT)* 21(RESV)* 22(RESV)*

### Library data of the parts
C54-C57 = CAP-0402: Capacitor
E1 = Antenna: Generic Antenna; Published: 24-Mar-1999; LatestRevisionDate: 17-Jul-2002; LatestRevisionNote: Re-released for DXP Platform.; PackageReference: PIN1; Publisher: Altium Limited
LED1-LED3 = LED-0402: BOM_Manufacturer: TOGIALED; Contributor: LCSC; BOM_Supplier: LCSC; BOM_Supplier Part: C917189; BOM_Manufacturer Part: TJ-S1005CL4T5ALC6B-A5; BOM_JLCPCB Part Class: Extended Part; spicePre: L; spiceSymbolName: TJ-S1005CL4T5ALC6B-A5
R35-R42 = RES-0402: Resistor
SW1 = TS-1199A-C-B: BOM_Manufacturer: XKB Enterprise; Contributor: LCSC; BOM_Supplier: LCSC; BOM_Supplier Part: C318880; BOM_Manufacturer Part: TS-1199A-C-B; BOM_JLCPCB Part Class: Extended Part; spicePre: S; spiceSymbolName: TS-1199A-C-B
SW2 SW3 = TS-1071AD-A1B3-D4: BOM_Manufacturer: Yuandi; Contributor: LCSC; BOM_Supplier: LCSC; BOM_Supplier Part: C492878; BOM_Manufacturer Part: TS-1071AD-A1B3-D4; BOM_JLCPCB Part Class: Extended Part; spicePre: S; spiceSymbolName: TS-1071AD-A1B3-D4
SW4 = TSX073G50D-250: BOM_Manufacturer: BRIGHT; Contributor: LCSC; BOM_Supplier: LCSC; BOM_Supplier Part: C722953; BOM_Manufacturer Part: TSX073G50D-250; BOM_JLCPCB Part Class: Extended Part; spicePre: S; spiceSymbolName: TSX073G50D-250
U9 = 1.14TFT焊接式: BOM_Manufacturer: 中景园; BOM_Manufacturer Part: 1.14寸LCD; Contributor: lanlanzhilian; BOM_Supplier: LCSC; BOM_Supplier Part: 1.14寸LCD; link: https://item.taobao.com/item.htm?spm=a1z09.2.0.0.71822e8drxlmEN&id=586638527978&_u=v83q7ore291; spicePre: U; spiceSymbolName: 1.14TFT焊接式
U10 = RTL8188EUS: Contributor: Robin00; spicePre: U; spiceSymbolName: RTL8188EUS
U11 = MPU6050: spicePre: U; spiceSymbolName: MPU6050

## Nets that join several sheets
GND: core_pwr (104 pins), core_app (23 pins), power (23 pins), conn (24 pins), peroherals (23 pins)
VCC_DRAM: core_pwr (39 pins), power (C46.2 L3.2 R21.2)
VCC_IO: core_pwr (17 pins), power (8 pins), conn (L10.2), peroherals (9 pins)
VCC_USB: power (Q1.3), conn (L7.1 L9.1)
VCC_WIFI: power (C47.2 L4.2 R22.2), peroherals (U10.1)
VDD_AVCC: core_pwr (R1.1 U1.K6 U1.N3 U1.V3), power (C50.2 C51.2 L5.2)
VDD_CPUFB: core_pwr (R8.1 U1.T10), power (R16.2)
VDD_CPUS: core_pwr (C20.1 C21.1 U1.J7 U1.J8), core_app (U1.M4)
VDD_CPUX: core_pwr (17 pins), power (C41.2 L1.1)
VDD_EPHY: core_pwr (U1.F8), power (R25.1)
VDD_SYS: core_pwr (15 pins), power (C49.2 L6.2 R25.2 R27.2)
AP-RESET#: core_app (U1.V6), peroherals (C55.2 R36.1 SW2.1)
GPIOG11: core_app (U1.D2), peroherals (R40.2)
GPIOL8/PWR-STB: core_app (U1.T2), power (R26.1 U4.4 U7.1)
GPIOL9/PWR-DRAM: core_app (U1.M6), power (R20.1 U5.1)
GPIOL10/PWR-LED: core_app (U1.V2), peroherals (R39.2)
HHPD: core_pwr (U1.M2), conn (R31.2 R32.2)
HSCL: core_pwr (U1.H3), conn (CN1.17)
HSDA: core_pwr (U1.K3), conn (CN1.18)
HTX0_N: core_pwr (U1.F1), conn (CN1.11)
HTX0_P: core_pwr (U1.G1), conn (CN1.9)
HTX1_N: core_pwr (U1.G2), conn (CN1.8)
HTX1_P: core_pwr (U1.H2), conn (CN1.6)
HTX2_N: core_pwr (U1.J2), conn (CN1.5)
HTX2_P: core_pwr (U1.J1), conn (CN1.3)
HTXC_N: core_pwr (U1.E2), conn (CN1.14)
HTXC_P: core_pwr (U1.F2), conn (CN1.12)
I2C0_SCL: core_app (U1.F11), peroherals (R41.2 U11.23)
I2C0_SDA: core_app (U1.C13), peroherals (R42.2 U11.24)
KEY_CHECK: core_app (U1.H16), peroherals (C54.2 R35.1 SW1.1)
SDC0-CLK: core_app (U1.D20), conn (CARD1.5)
SDC0-CMD: core_app (U1.F18), conn (CARD1.3 R33.2)
SDC0-D0: core_app (U1.A19), conn (CARD1.7)
SDC0-D1: core_app (U1.D19), conn (CARD1.8)
SDC0-D2: core_app (U1.C20), conn (CARD1.1)
SDC0-D3: core_app (U1.E21), conn (CARD1.2)
SDC0-DET: core_app (U1.G18), conn (CARD1.9 R34.2)
STATUS_LED: core_app (U1.E11), peroherals (R38.2)
SVREF: core_pwr (C24.1 C33.2 R9.2 R10.1), core_app (7 pins)
SW_DOWN: core_app (U1.F17), peroherals (SW4.6)
SW_LEFT: core_app (U1.C18), peroherals (SW4.2)
SW_MID: core_app (U1.C19), peroherals (SW4.1)
SW_RIGHT: core_app (U1.B17), peroherals (SW4.3)
SW_UP: core_app (U1.B19), peroherals (SW4.4)
UART0_RX: core_app (U1.H6), conn (U8.8)
UART0_TX: core_app (U1.F5), conn (U8.9)
UBOOT: core_app (U1.W6), peroherals (C56.2 R37.1 SW3.1)
USB0D_N: core_app (U1.B5), conn (USB1.A7 USB1.B7)
USB0D_P: core_app (U1.A5), conn (USB1.A6 USB1.B6)
USB1D_N: core_app (U1.B7), peroherals (U10.2)
USB1D_P: core_app (U1.B6), peroherals (U10.3)